# Altium schematic sheet USB-UART Converter (FT232).SchDoc: Optoisolated USB to UART Converter
size A4; ApprovedBy: LD Stanton; Author: LD Stanton; CompanyName: University of Cape Town; DrawnBy: Lawrence Stanton; Engineer: Lawrence Stanton; Organization: University of Cape Town; Address1: Department of Electrical Engineering; Address2: Rondebosch; Address3: Cape Town; Address4: South Africa 7701; DocumentNumber: 15; SheetNumber: 15; SheetTotal: 20
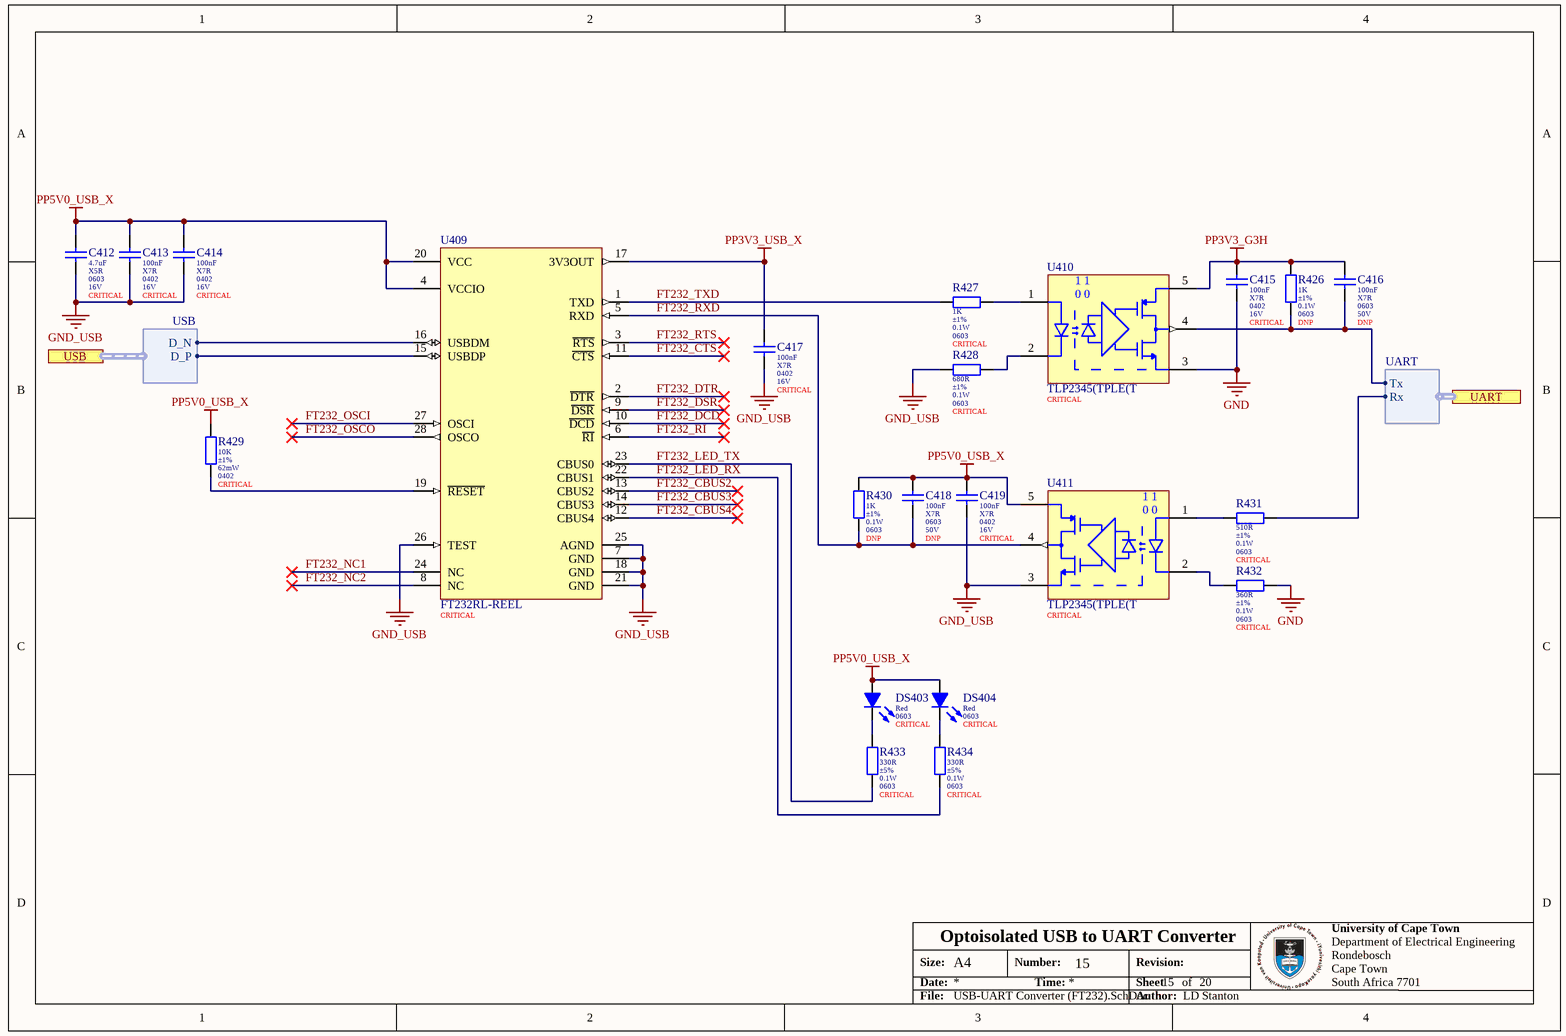
[diagram p0: USB-UART Converter (FT232).SchDoc]

## Parts
C412  value 4.7uF  Dielectric: X5R  Package: 0603  Voltage: 16V  Populate: CRITICAL  [0603_080_8 (Samsung) B]  (hidden comment: CL10A475KO8NNNC)
C413  value 100nF  Dielectric: X7R  Package: 0402  Voltage: 16V  Populate: CRITICAL  [0402_050_5 (Samsumg) B]  (hidden comment: CL05B104KO5NNNC)
C414  value 100nF  Dielectric: X7R  Package: 0402  Voltage: 16V  Populate: CRITICAL  [0402_050_5 (Samsumg) B]  (hidden comment: CL05B104KO5NNNC)
C415  value 100nF  Dielectric: X7R  Package: 0402  Voltage: 16V  Populate: CRITICAL  [0402_050_5 (Samsumg) B]  (hidden comment: CL05B104KO5NNNC)
C416  value 100nF  Dielectric: X7R  Package: 0603  Voltage: 50V  Populate: DNP  [0603 (Yageo DA) B]  (hidden comment: CC0603KRX7R9BB104)
C417  value 100nF  Dielectric: X7R  Package: 0402  Voltage: 16V  Populate: CRITICAL  [0402_050_5 (Samsumg) B]  (hidden comment: CL05B104KO5NNNC)
C418  value 100nF  Dielectric: X7R  Package: 0603  Voltage: 50V  Populate: DNP  [0603 (Yageo DA) B]  (hidden comment: CC0603KRX7R9BB104)
C419  value 100nF  Dielectric: X7R  Package: 0402  Voltage: 16V  Populate: CRITICAL  [0402_050_5 (Samsumg) B]  (hidden comment: CL05B104KO5NNNC)
DS403  Colour: Red  Package: 0603  Placement: CRITICAL  [LED 0603 (Everlight) B]  (hidden comment: 19-217/R6C-AL1M2VY/3T)
DS404  Colour: Red  Package: 0603  Placement: CRITICAL  [LED 0603 (Everlight) B]  (hidden comment: 19-217/R6C-AL1M2VY/3T)
R426  value 1K  Tolerance: ±1%  Power: 0.1W  Package: 0603  Populate: DNP  [0603 (Uniroyal) B]  (hidden comment: 0603WAF1001T5E)
R427  value 1K  Tolerance: ±1%  Power: 0.1W  Package: 0603  Populate: CRITICAL  [0603 (Uniroyal) B]  (hidden comment: 0603WAF1001T5E)
R428  value 680R  Tolerance: ±1%  Power: 0.1W  Package: 0603  Populate: CRITICAL  [0603 (Uniroyal) B]  (hidden comment: 0603WAF6800T5E)
R429  value 10K  Tolerance: ±1%  Power: 62mW  Package: 0402  Populate: CRITICAL  [0402 (Uniroyal) B]  (hidden comment: 0402WGF1002TCE)
R430  value 1K  Tolerance: ±1%  Power: 0.1W  Package: 0603  Populate: DNP  [0603 (Uniroyal) B]  (hidden comment: 0603WAF1001T5E)
R431  value 510R  Tolerance: ±1%  Power: 0.1W  Package: 0603  Populate: CRITICAL  [0603 (Uniroyal) B]  (hidden comment: 0603WAF5100T5E)
R432  value 360R  Tolerance: ±1%  Power: 0.1W  Package: 0603  Populate: CRITICAL  [0603 (Uniroyal) B]  (hidden comment: 0603WAF3600T5E)
R433  value 330R  Tolerance: ±5%  Power: 0.1W  Package: 0603  Populate: CRITICAL  [0603 (Uniroyal) B]  (hidden comment: 0603WAJ0331T5E)
R434  value 330R  Tolerance: ±5%  Power: 0.1W  Package: 0603  Populate: CRITICAL  [0603 (Uniroyal) B]  (hidden comment: 0603WAJ0331T5E)
U409  FT232RL-REEL  Placement: CRITICAL  [SSOP-28 (FT232) B]
U410  TLP2345(TPLE(T  Placement: CRITICAL  [SO-5 (TLP23) B]
U411  TLP2345(TPLE(T  Placement: CRITICAL  [SO-5 (TLP23) B]

## Ports
UART (harness UART), USB (harness USB)

## Harnesses
UART: Rx, Tx
USB: D_P, D_N

## Nets
GND: C415.2 R432.2 U410.3(GND)
GND_USB: C412.2 C413.2 C414.2 C417.2 C419.2 R428.1 U409.7(GND) U409.18(GND) U409.21(GND) U409.25(AGND) U409.26(TEST) U411.3(GND)
PP3V3_G3H: C415.1 C416.1 R426.2 U410.5(VDD)
PP3V3_USB_X: C417.1 U409.17(3V3OUT)
PP5V0_USB_X: C412.1 C413.1 C414.1 C418.1 C419.1 DS403.A DS404.A R429.1 R430.2 U409.4(VCCIO) U409.20(VCC) U411.5(VDD)
FT232_CBUS2: U409.13(CBUS2)
FT232_CBUS3: U409.14(CBUS3)
FT232_CBUS4: U409.12(CBUS4)
FT232_CTS: U409.11(~{CTS})
FT232_DCD: U409.10(~{DCD})
FT232_DSR: U409.9(~{DSR})
FT232_DTR: U409.2(~{DTR})
FT232_LED_RX: R434.2 U409.22(CBUS1)
FT232_LED_TX: R433.2 U409.23(CBUS0)
FT232_NC1: U409.24(NC)
FT232_NC2: U409.8(NC)
FT232_OSCI: U409.27(OSCI)
FT232_OSCO: U409.28(OSCO)
FT232_RI: U409.6(~{RI})
FT232_RTS: U409.3(~{RTS})
FT232_RXD: C418.2 R430.1 U409.5(RXD) U411.4(VO)
FT232_TXD: R427.1 U409.1(TXD)
NetC416_2: C416.2 R426.1 U410.4(VO) ; port UART.Tx
NetDS403_K: DS403.K R433.1
NetDS404_K: DS404.K R434.1
NetR427_2: R427.2 U410.1(A)
NetR428_2: R428.2 U410.2(C)
NetR429_2: R429.2 U409.19(~{RESET})
NetR431_1: R431.1 U411.1(A)
NetR431_2: R431.2 ; port UART.Rx
NetR432_1: R432.1 U411.2(C)
NetU409_15: U409.15(USBDP) ; port USB.D_P
NetU409_16: U409.16(USBDM) ; port USB.D_N

## Notes on the sheet
- Size:
- Date:
- A4
- Number:
- Time:
- Revision:
- Sheet
- of
- File:
- Author:
- (in symbol CMP-00026-00001-3) 1 1; 0 0

## Library data of the parts
C412 = CMP-014-000007-5: MLCC 4.7uF 0603 16V X5R ±10%; Manufacturer: Samsung; LCSC Part Number: C19666; ComponentLink1Description: Datasheet; Tolerance: ±10%; ComponentLink1URL: https://datasheet.lcsc.com/szlcsc/Samsung-Electro-Mechanics-CL05C100JB5NNNC_C32949.pdf
C413-C415 C417 C419 = CMP-045-000014-12: MLCC 100nF 0402 16V X7R ±10%; Manufacturer: Samsung; ComponentLink1Description: Datasheet; ComponentLink1URL: https://datasheet.lcsc.com/szlcsc/Samsung-Electro-Mechanics-CL05C100JB5NNNC_C32949.pdf; LCSC Part Number: C1525; Tolerance: ±10%
C416 C418 = CMP-047-000000-7: MLCC 100nF 50V 0603 X7R ±10%; Manufacturer: Yageo; LCSC Part Number: C14663; Tolerance: ±10%; ComponentLink1URL: https://datasheet.lcsc.com/szlcsc/YAGEO-CC0603KRX7R9BB104_C14663.pdf; ComponentLink1Description: Datasheet
DS403 DS404 = CMP-007-00000-1: LED 0603 SMT Red; Manufacturer: Everlight; Maximum Forward Current: 20mA; Forward Voltage: 2.2V; ComponentLink1Description: Datasheet; RoHS Compliant: Yes; ComponentLink1URL: https://datasheet.lcsc.com/lcsc/1811101510_Everlight-Elec-19-217-R6C-AL1M2VY-3T_C72044.pdf; LCSC Part Number: C72044
R426 R427 R430 = CMP-010-000308-10: Resistor 1K0 0603 ±1% Thick Film Uniroyal; Working Voltage: 50V; Temperature Coefficient: ±100ppm/K; ComponentLink1URL: https://datasheet.lcsc.com/szlcsc/1811062009_UNI-ROYAL-Uniroyal-Elec-0603WAF1002T5E_C25804.pdf; LCSC Part Number: C21190; Pin Count: 2; Manufacturer: Uniroyal; ComponentLink1Description: Datasheet; Temperature: -55 - 155°C
R428 = CMP-010-000394-2: Resistor 680R 0603 ±1% Thick Film Uniroyal; Working Voltage: 50V; Temperature Coefficient: ±100ppm/K; ComponentLink1Description: Datasheet; Pin Count: 2; ComponentLink1URL: https://datasheet.lcsc.com/szlcsc/1811062009_UNI-ROYAL-Uniroyal-Elec-0603WAF1002T5E_C25804.pdf; Temperature: -55 - 155°C; Manufacturer: Uniroyal; LCSC Part Number: C23228
R429 = CMP-010-000292-12: Resistor 10K 0402 ±1% Thick Film Uniroyal; Working Voltage: 50V; Temperature Coefficient: ±100ppm/K; Manufacturer: Uniroyal; Pin Count: 2; ComponentLink1URL: https://datasheet.lcsc.com/szlcsc/1811062009_UNI-ROYAL-Uniroyal-Elec-0603WAF1002T5E_C25804.pdf; LCSC Part Number: C25744; Temperature: -55 - 155°C; ComponentLink1Description: Datasheet
R431 = CMP-010-000390-1: Resistor 510R 0603 ±1% Thick Film Uniroyal; Temperature Coefficient: ±200ppm/K; Working Voltage: 50V; Pin Count: 2; LCSC Part Number: C23193; ComponentLink1URL: https://datasheet.lcsc.com/szlcsc/1811062009_UNI-ROYAL-Uniroyal-Elec-0603WAF1002T5E_C25804.pdf; Temperature: -55 - 155°C; Manufacturer: Uniroyal; ComponentLink1Description: Datasheet
R432 = CMP-010-000392-1: Resistor 360R 0603 ±1% Thick Film Uniroyal; Working Voltage: 50V; Temperature Coefficient: ±200ppm/K; ComponentLink1URL: https://datasheet.lcsc.com/szlcsc/1811062009_UNI-ROYAL-Uniroyal-Elec-0603WAF1002T5E_C25804.pdf; LCSC Part Number: C25194; Temperature: -55 - 155°C; Pin Count: 2; Manufacturer: Uniroyal; ComponentLink1Description: Datasheet
R433 R434 = CMP-010-000330-10: Resistor 330R 0603 ±5% Thick Film Uniroyal; Temperature Coefficient: ±100ppm/K; Working Voltage: 50V; ComponentLink1Description: Datasheet; ComponentLink1URL: https://datasheet.lcsc.com/szlcsc/1811062009_UNI-ROYAL-Uniroyal-Elec-0603WAF1002T5E_C25804.pdf; Manufacturer: Uniroyal; Pin Count: 2; Temperature: -55 - 155°C; LCSC Part Number: C23138
U409 = CMP-049-000000-2: USB/UART Converter USB FS SSOP-28 FTDI; Pin Count: 28; LCSC Part Number: C8690; ComponentLink1Description: Datasheet; ComponentLink1URL: https://www.ftdichip.com/Support/Documents/DataSheets/ICs/DS_FT232R.pdf
U410 U411 = CMP-00026-00001-3: Optocoupler Logic-Out Totem-Pole Logic, Buffer-IN 1-CH 5-Pin SO T/R; Forward Voltage: 1V55; Forward Current: 2mA; Output Current: ±50mA; Propagation Delay: 120ns; Isolation Voltage: 3.75kV; LCSC Part Number: C99484; RoHS Compliant: Yes; ComponentLink1Description: Datasheet; Max Operating Temperature: 110°C; ComponentLink1URL: https://datasheet.lcsc.com/lcsc/1811092313_TOSHIBA-TLP2345-TPL,E_C99484.pdf; Case/Package: SO; Min Operating Temperature: -40°C